# Altium project Adapter_JLink_EDU.PrjPcb
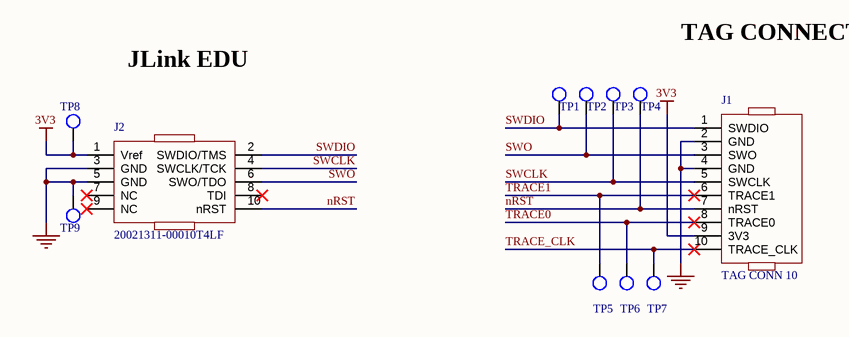
[diagram p0: Adapter_JLink_EDU.SchDoc]
1 sheet, 11 parts. Net scope: global (net labels, ports and power ports of the same name join across sheets).
Board file: Adapter_JLink_EDU.PcbDoc

## Sheet Adapter_JLink_EDU.SchDoc
size 431 x 279 mm; Organization: ORGANIZATION; Address1: 207; Address2: 13399 104 Ave; Address3: Surrey BC, V3T 0C9; Address4: Canada; Revision: -; SheetNumber: 1; SheetTotal: 1; ENG_APP_DATE: --/--/--; DSN_APP_DATE: --/--/--; CHK_APP_DATE: --/--/--

### Parts
J1  TAG CONN 10  [CONN HDR RECPT 20 2.54 TH TAG CONNECT 10]
J2  20021311-00010T4LF  [CONN HDR PLUG 10 1.27mm JLink EDU]
TP1  1mm  [TESTPOINT_SMT]  (value not drawn)
TP2  1mm  [TESTPOINT_SMT]  (value not drawn)
TP3  1mm  [TESTPOINT_SMT]  (value not drawn)
TP4  1mm  [TESTPOINT_SMT]  (value not drawn)
TP5  1mm  [TESTPOINT_SMT]  (value not drawn)
TP6  1mm  [TESTPOINT_SMT]  (value not drawn)
TP7  1mm  [TESTPOINT_SMT]  (value not drawn)
TP8  1mm  [TESTPOINT_SMT]  (value not drawn)
TP9  1mm  [TESTPOINT_SMT]  (value not drawn)

### Nets
3V3: J1.9(3V3) J2.1(Vref) TP8.1
GND: J1.2(GND) J1.4(GND) J2.3(GND) J2.5(GND) TP9.1
nRST: J1.7(nRST) J2.10(nRST) TP4.1
SWCLK: J1.5(SWCLK) J2.4(SWCLK/TCK) TP3.1
SWDIO: J1.1(SWDIO) J2.2(SWDIO/TMS) TP1.1
SWO: J1.3(SWO) J2.6(SWO/TDO) TP2.1
TRACE0: J1.8(TRACE0) TP6.1
TRACE1: J1.6(TRACE1) TP5.1
TRACE_CLK: J1.10(TRACE_CLK) TP7.1

Not connected (* = marked no-connect by the designer): J2 7(NC)* 8(TDI)* 9(NC)*

### Notes on the sheet
- JLink EDU
- TAG CONNECT
- REV:
- PROJECT
- FaustOEM
- DESIGN ITEM:
- TITLE
- SHEET
- OF

### Library data of the parts
J1 = CONN HDR RECPT 10 2.54mm TH SWV: Conn Shrouded Header HDR 10 POS 2.54mm Solder ST Thru-Hole; Manufacturer: On-Shore Technology; Manufacturer Part Number: 302-S101; Number of Positions: 10; Connector Type: Male Pin; Pitch: 0.1inch; Supplier 1: Digi-Key; RoHS: Yes; Category: Connectors; Stock 1: 61558; Pricing 1: 1=0.29000, 10=0.24800, 100=0.19290, 500=0.16538, 1000=0.13781, 5000=0.11812, 10000=0.11025 (USD); Mount: Through Hole; Color: Black; Contact Plating: Gold; Number of Rows: 2; Packaging: Tray; Termination: Solder; Series: 302; Contact Type: Male Pin; Row Spacing: 0.1inch; ComponentLink1URL: https://datasheet.ciiva.com/732/302-sxxx-732946.pdf?src-supplier=Digi-Key; ComponentLink1Description: https://datasheet.ciiva.com/732/302-sxxx-732946.pdf?src-supplier=Digi-Key; Supplier Part Number 1: ED1543-ND
J2 = CONN HDR RECPT 10 1.27mm TH 20021311-00010T4LF: Dual Row 10 Position 1.27 mm Board to Board Through Hole Female Socket Connector; Manufacturer 1: Amphenol ICC / FCI; Category 1: Headers and Wire Housings; Supplier 1: Newark; Supplier Part Number 1: 38AH4107; Manufacturer Part Number 1: 20021311-00010T4LF; RoHS 1: No; Description 1: Dual Row 10 Position 1.27 mm Board to Board Through Hole Female Socket Connector; ComponentLink1URL: http://components.arrow.com/part/dataview/48963183S8522640N8314?src-supplier=Arrow+Electronics; ComponentLink1Description: http://components.arrow.com/part/dataview/48963183S8522640N8314?src-supplier=Arrow+Electronics; ComponentLink2URL: http://portal.fciconnect.com/Comergent/fci/drawing/20021311.pdf?src-supplier=Avnet; ComponentLink2Description: http://portal.fciconnect.com/Comergent/fci/drawing/20021311.pdf?src-supplier=Avnet; ComponentLink3URL: http://portal.fciconnect.com/Comergent//fci/drawing/20021311.pdf?src-supplier=Mouser; ComponentLink3Description: http://portal.fciconnect.com/Comergent//fci/drawing/20021311.pdf?src-supplier=Mouser; ComponentLink4URL: http://www.farnell.com/datasheets/1079639.pdf?src-supplier=Element14; ComponentLink4Description: http://www.farnell.com/datasheets/1079639.pdf?src-supplier=Element14; ComponentLink5URL: https://media.digikey.com/pdf/Data%20Sheets/FCI%20PDFs/Minitek%20127_Catalog.pdf?src-supplier=Digi-Key; ComponentLink5Description: https://media.digikey.com/pdf/Data%20Sheets/FCI%20PDFs/Minitek%20127_Catalog.pdf?src-supplier=Digi-Key; ComponentLink6URL: http://www.farnell.com/datasheets/2374175.pdf?src-supplier=Farnell; ComponentLink6Description: http://www.farnell.com/datasheets/2374175.pdf?src-supplier=Farnell
TP1-TP9 = TP 1mm: SMT testpoint